# Altium schematic sheet POWER_DEVIDER.SchDoc
size 250 x 199 mm; SheetNumber: 2; SheetTotal: 6
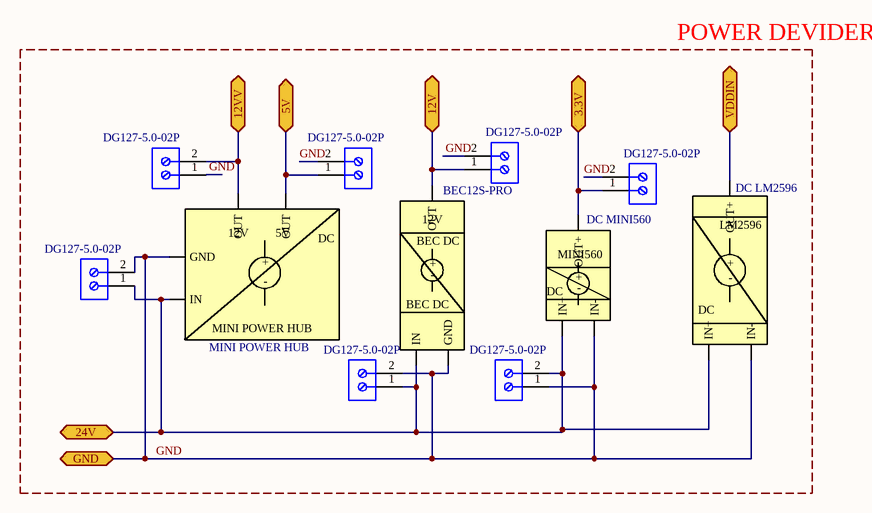
[diagram p0: POWER_DEVIDER.SchDoc]

## Parts
DC1  MINI POWER HUB  [MINI POWER HUB]
DC2  BEC12S-PRO  [BEC12S-PRO]
DC3  DC MINI560  [MINI560]
DC4  DC LM2596  [DC LM2596]
DGBECIN  DG127-5.0-02P  [DG127-5.0-02P]
DGBECOUT  DG127-5.0-02P  [DG127-5.0-02P]
DGHUBIN  DG127-5.0-02P  [DG127-5.0-02P]
DGHUBOUT5  DG127-5.0-02P  [DG127-5.0-02P]
DGHUBOUT12  DG127-5.0-02P  [DG127-5.0-02P]
DGMINIIN  DG127-5.0-02P  [DG127-5.0-02P]
DGMINIOUT  DG127-5.0-02P  [DG127-5.0-02P]

## Blocks framed on the sheet
POWER DEVIDER: DC1-DC4 DGBECIN DGBECOUT DGHUBIN DGHUBOUT5 DGHUBOUT12 DGMINIIN DGMINIOUT

## Ports
3.3V (bidir), 5V (bidir), 12V (bidir), 12VV (bidir), 24V (bidir), GND (bidir), VDDIN (bidir)

## Nets
3.3V: DC3.3(OUT+) DGMINIOUT.1 ; port 3.3V
5V: DC1.4(OUT) DGHUBOUT5.1 ; port 5V
12V: DC2.3(OUT) DGBECOUT.1 ; port 12V
12VV: DC1.3(OUT) DGHUBOUT12.2 ; port 12VV
24V: DC1.1(IN) DC2.1(IN) DC3.1(IN+) DC4.1(IN+) DGBECIN.1 DGHUBIN.1 DGMINIIN.2 ; port 24V
GND: DC1.2(GND) DC2.2(GND) DC3.2(IN-) DC4.2(IN-) DGBECIN.2 DGBECOUT.2 DGHUBIN.2 DGHUBOUT5.2 DGHUBOUT12.1 DGMINIIN.1 DGMINIOUT.2 ; port GND
VDDIN: DC4.3(OUT+) ; port VDDIN

## Notes on the sheet
- (in symbol BEC12S-PRO) 12V; BEC DC; +; -
- (in symbol DC LM2596) LM2596; +; -; DC
- (in symbol DC MINI560) MINI560; +; DC; -
- (in symbol MINI POWER HUB) 12V; 5V; DC; +; -

## Library data of the parts
DC1 = MINI POWER HUB: DC-DC MINU POWER HUB BEC 5V & 12V
DC2 = BEC12S-PRO: DC-DC BEC12S-PRO
DC3 = DC MINI560: MINI560 PRO DC-DC
DC4 = DC LM2596: LM2596 DC-DC
DGBECIN DGBECOUT DGHUBIN DGHUBOUT5 DGHUBOUT12 DGMINIIN DGMINIOUT = DG127-5.0-02P: DG127-5.0-02P-14-00Z